# Altium project KS2E_FanController.PrjPcb
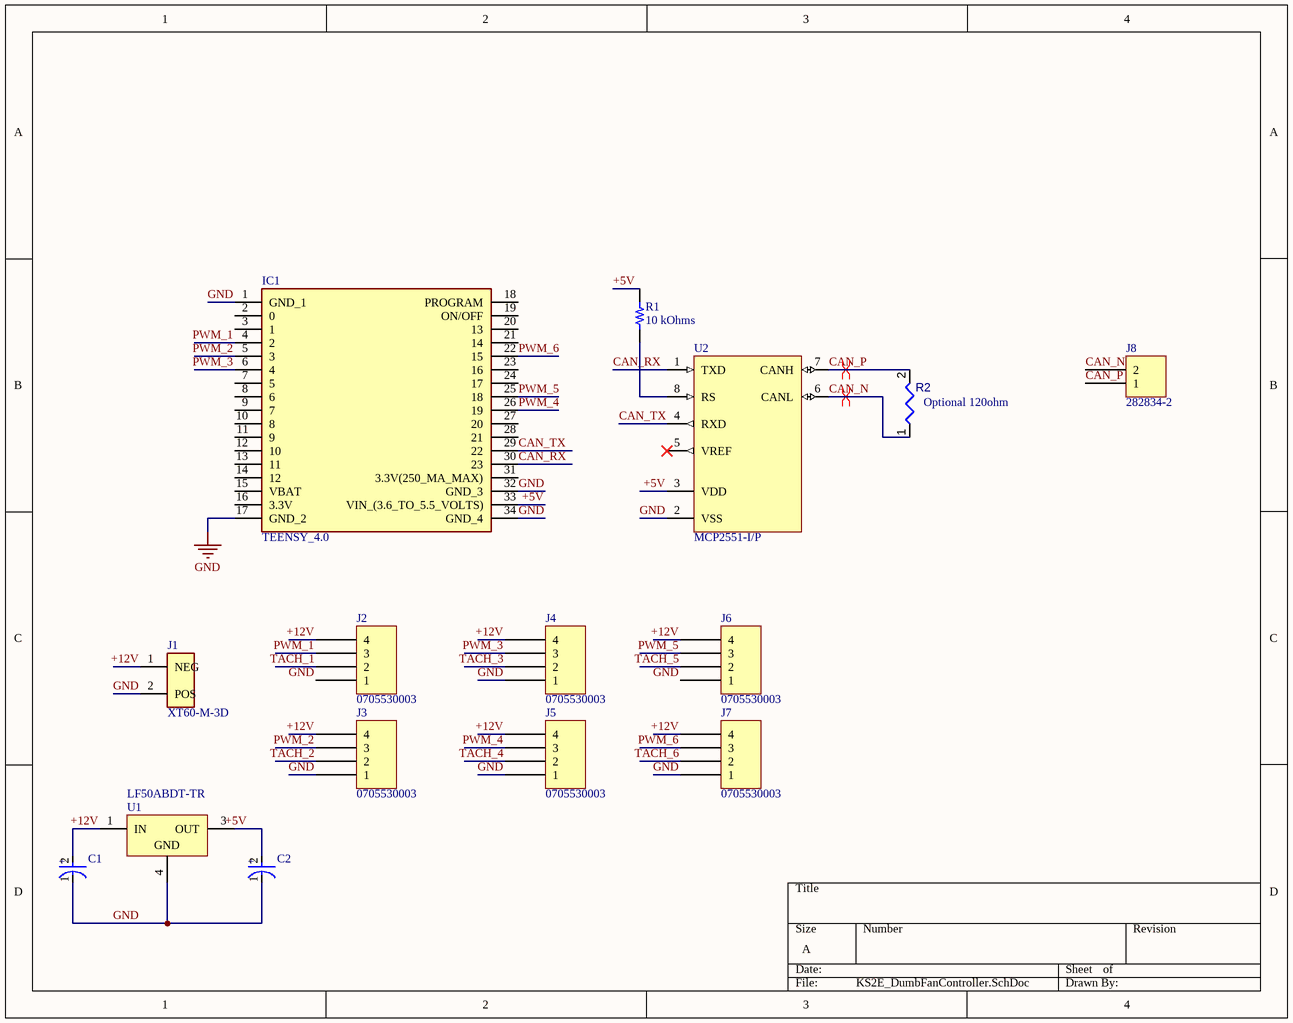
[diagram p0: KS2E_DumbFanController.SchDoc]
1 sheet, 15 parts. Net scope: global (net labels, ports and power ports of the same name join across sheets).
Board file: KS2E_FC.PcbDoc

## Sheet KS2E_DumbFanController.SchDoc
size A; SheetNumber: 1; SheetTotal: 1

### Parts
C1  EEEFK1E100R  [FP-FKB-MFG]  (value not drawn)
C2  EEEFK1E100R  [FP-FKB-MFG]  (value not drawn)
IC1  TEENSY_4.0  [TEENSY40]
J1  XT60-M-3D  [AMASS_XT60-M]
J2  0705530003  [MOLEX SDA-70553-4PIN]
J3  0705530003  [MOLEX SDA-70553-4PIN]
J4  0705530003  [MOLEX SDA-70553-4PIN]
J5  0705530003  [MOLEX SDA-70553-4PIN]
J6  0705530003  [MOLEX SDA-70553-4PIN]
J7  0705530003  [MOLEX SDA-70553-4PIN]
J8  282834-2  [TE 282834-2]
R1  10 kOhms  [RES 1206_3216]
R2  Jumper 0603  [RESC0603(1608)_L]  (value not drawn)
U1  LF50ABDT-TR  [TO-252_M]
U2  MCP2551-I/P  [PDIP300-P8]

### Nets
GND: C1.1(C) C2.1(C) IC1.1(GND_1) IC1.17(GND_2) IC1.32(GND_3) IC1.34(GND_4) J1.2(POS) J2.1 J3.1 J4.1 J5.1 J6.1 J7.1 U1.4(GND) U2.2(VSS)
+5V: C2.2(A) IC1.33(VIN_(3.6_TO_5.5_VOLTS)) R1.2 U1.3(OUT) U2.3(VDD)
+12V: C1.2(A) J1.1(NEG) J2.4 J3.4 J4.4 J5.4 J6.4 J7.4 U1.1(IN)
CAN_N: J8.2 R2.1 U2.6(CANL)
CAN_P: J8.1 R2.2 U2.7(CANH)
CAN_RX: IC1.30(23) U2.1(TXD)
CAN_TX: IC1.29(22) U2.4(RXD)
PWM_1: IC1.4(2) J2.3
PWM_2: IC1.5(3) J3.3
PWM_3: IC1.6(4) J4.3
PWM_4: IC1.26(19) J5.3
PWM_5: IC1.25(18) J6.3
PWM_6: IC1.22(15) J7.3
TACH_1: J2.2
TACH_2: J3.2
TACH_3: J4.2
TACH_4: J5.2
TACH_5: J6.2
TACH_6: J7.2
NetR1_1: R1.1 U2.8(RS)

Not connected (* = marked no-connect by the designer): IC1 2(0) 3(1) 7(5) 8(6) 9(7) 10(8) 11(9) 12(10) 13(11) 14(12) 15(VBAT) 16(3.3V) 18(PROGRAM) 19(ON/OFF) 20(13) 21(14) 23(16) 24(17) 27(20) 28(21) 31(3.3V(250_MA_MAX)); U2 5(VREF)*

### Layout directives
differential pair: CAN_N, CAN_P

### Notes on the sheet
- (near R2) Optional 120ohm
- (in symbol CMP-05427-000055-1) +

### Library data of the parts
C1 C2 = CMP-05427-000055-1: CAP ALUM 10UF 20% 25V SMD; ESR (Equivalent Series Resistance): 1.35R; Life (Hours): 2000Hour; Dielectric Material: Aluminium; Leakage Current: 3uA; Ripple Current (AC): 90mA; Polarity: Polar; Voltage: 25V; Voltage Rating: 25V; Number of Pins: 2; Package Quantity: 1; Max Operating Temperature: 105°C; Tolerance: 20%; Voltage Rating (DC): 25V; Packaging: Tape and Reel; Impedance: 1.35R; Case/Package: Radial; Series: FK; Height - Seated (Max): 0.24inch; Diameter: 4mm; Length: 5.8mm; Construction: Cylindrical; Height: 5.8mm; Mount: Surface Mount; REACH SVHC: No SVHC; Termination: SMD/SMT; Capacitance: 10uF; Lead Free: Lead Free; RoHS Compliant: Yes; Contact Plating: Tin; Width: 5.5mm; Radiation Hardening: No; Min Operating Temperature: -55°C; Ripple Current: 90mA
IC1 = TEENSY_4.0: Integrated Circuit; Manufacturer_Name: Teensy; Manufacturer_Part_Number: TEENSY 4.0; Datasheet Link: https://www.pjrc.com/store/teensy40.html; Height: 4.64mm
J1 = XT60-M-3D: Plug; DC supply; XT60; male; PIN: 2; for cable; soldered; 30A; 500V; MP: XT60-M; MF: AMASS; Price: None; Package: Package Analog Devices; Value: *; Availability: Unavailable; SnapEDA_Link: https://www.snapeda.com/parts/XT60-M/AMASS/view-part/2883912/?ref=snap
J2-J7 = 0705530003: CONN HEADER R/A 4POS 2.54MM; Manufacturer: Molex; Contact Length - Mating: 0.240" (6.10mm); Contact Length - Post: 0.130" (3.30mm); Material Flammability Rating: UL94 V-0; Number of Positions: 4; Number of Positions Loaded: All; Pitch - Mating: 0.100" (2.54mm); Shrouding: Shrouded - 4 Wall; Style: Board to Cable/Wire; Voltage Rating: 250V; Part Number: 0705530003; ComponentLink1Description: Datasheet; ComponentLink1URL: https://www.molex.com/pdm_docs/sd/705530002_sd.pdf; ComponentLink2Description: DigiKey Link; ComponentLink2URL: http://digikey.com/product-detail/en/molex/0705530003/WM4902-ND/114959; Connector Type: Header; Contact Finish - Mating: Gold; Contact Finish - Post: Tin; Contact Finish Thickness - Mating: 15.0µin (0.38µm); Contact Material: Phosphor Bronze; Contact Shape: Square; Contact Type: Male Pin; Fastening Type: Latch Holder; Insulation Color: Black; Insulation Height: 0.215" (5.45mm); Insulation Material: Polyester, Glass Filled; LastUpdated: 1/12/2020 11:56:17 PM; Lifecycle Status: Active; Minimum Order: 1; Mounting Type: Through Hole, Right Angle; Number of Rows: 1; Operating Temperature: -40°C ~ 105°C; Packaging: Tube; PartId: 87; Part Status: Active; Price: 1.05; Series: SL 70553; Supplier 1: DigiKey; Supplier Part Number 1: WM4902-ND; Termination: Solder
J8 = 282834-2: TERM BLK 2P SIDE ENT 2.54MM PCB; Manufacturer: TE Connectivity AMP Connectors; Current: 10A; Mating Orientation: Horizontal with Board; Number of Levels: 1; Pitch: 0.100" (2.54mm); Positions Per Level: 2; Voltage: 150V; Wire Gauge: 16-30 AWG; Wire Termination: Screw - Rising Cage Clamp; Part Number: 282834-2; Color: Green; ComponentLink1Description: Datasheet; ComponentLink1URL: https://www.te.com/commerce/DocumentDelivery/DDEController?Action=srchrtrv&DocNm=282834&DocType=Customer+Drawing&DocLang=English; ComponentLink2Description: DigiKey Link; ComponentLink2URL: http://digikey.com/product-detail/en/te-connectivity-amp-connectors/282834-2/A98333-ND/1150135; LastUpdated: 1/15/2020 4:15:38 AM; Lifecycle Status: Active; Minimum Order: 1; Mounting Type: Through Hole; Packaging: Bulk; Part Status: Active; Price: 0.88; Series: Buchanan; Supplier 1: DigiKey; Supplier Part Number 1: A98333-ND
R1 = CRG1206F10K: RES SMD 10K OHM 1% 1/4W 1206; Manufacturer: TE Connectivity Passive Product; Power (Watts): 0.25W, 1/4W; Temperature Coefficient: ±100ppm/°C; Part Number: CRG1206F10K; ComponentLink1Description: Datasheet; ComponentLink1URL: https://www.te.com/commerce/DocumentDelivery/DDEController?Action=srchrtrv&DocNm=1773204&DocType=DS&DocLang=English; ComponentLink2Description: DigiKey Link; ComponentLink2URL: http://digikey.com/product-detail/en/te-connectivity-passive-product/CRG1206F10K/A106069CT-ND/3477720; Composition: Thick Film; Device Package: 1206 (3216 Metric); Height - Seated (Max): 0.026" (0.65mm); LastUpdated: 9/2/2020 1:13:10 AM; Lifecycle Status: Active; Minimum Order: 1; Number of Terminations: 2; Operating Temperature: -55°C ~ 155°C; Package / Case: 1206 (3216 Metric); Packaging: TapeAndReel; PartId: 26989; Part Status: Active; Price: 0.01; Resistance: 10 kOhms; Series: CRG, Neohm; Size / Dimension: 0.122" L x 0.061" W (3.10mm x 1.55mm); Supplier 1: DigiKey; Supplier Part Number 1: A106069CT-ND; Supplier Device Package: 1206; Tolerance: ±1%; Value: 10 kOhms
R2 = CMP-009-00175-3: Value: 0; Pins: 2; Min Operating Temperature: -55°C; Max Operating Temperature: 155°C; Case/Package: 0603
U1 = CMP-0244-00070-1: 500mA, Very Low Drop (0.45V) Voltage Regulator, 5V, 3-Pin DPAK, Tape and Reel; DatasheetVersion: 1/11/2010; ComponentLink1URL: http://www.st.com; ComponentLink1Description: Manufacturer URL; ComponentLink2URL: http://www.st.com/internet/com/TECHNICAL_RESOURCES/TECHNICAL_LITERATURE/DATASHEET/CD00000546.pdf; PackageReference: TO-252; PackageDescription: 3-Pin Transistor Outline Package 2.28 mm Pitch, 9.7 mm Lead Span (DPAK); ComponentLink2Description: Datasheet; PackageVersion: 2011
U2 = CMP-0186-00101-2: High-Speed CAN Transceiver, 8-Pin PDIP, Industrial Temperature; PackageDescription: 8-Lead Plastic Dual In-Line (P) - 300 mil Body [PDIP]; Code_JEDEC: MS-001; ComponentLink1Description: Manufacturer URL; DatasheetVersion: revF, Jul-2010; PackageReference: PDIP300-P8; ComponentLink3Description: Package Specification; ComponentLink3URL: http://www.microchip.com/stellent/groups/techpub_sg/documents/packagingspec/en012702.pdf; ComponentLink2URL: http://ww1.microchip.com/downloads/en/DeviceDoc/21667F.pdf; ComponentLink1URL: http://www.microchip.com/; RevisionNote: URLs added. DatasheetVersion updated.; PackageVersion: revBB, Aug-2009; ComponentLink2Description: Datasheet